# EAGLE design Jar_O_Fireflies (EAGLE 5.11)
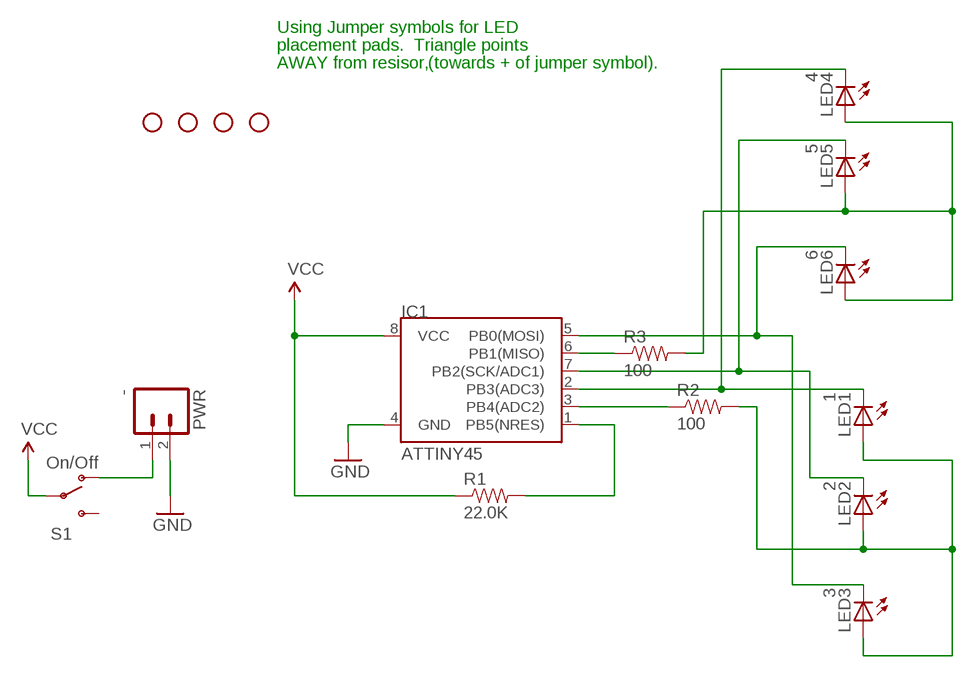
[diagram p0: schematic, sheet 1]

## Parts
IC1  ATTINY45  [SO08-EIAJ]
JP1  STAND-OFF  [STAND-OFF]
JP2  STAND-OFF  [STAND-OFF]
JP3  STAND-OFF  [STAND-OFF]
JP4  STAND-OFF  [STAND-OFF]
LED1  1  LED1206  [LED-1206]
LED2  2  LED1206  [LED-1206]
LED3  3  LED1206  [LED-1206]
LED4  4  LED1206  [LED-1206]
LED5  5  LED1206  [LED-1206]
LED6  6  LED1206  [LED-1206]
PWR  -  M02LOCK  [1X02_LOCK]
R1  22.0K  RESISTOR  [0805]
R2  100  RESISTOR  [0805]
R3  100  RESISTOR  [0805]
S1  On/Off  SWITCH-SPSTSMD2  [SWITCH-SPDT-SMD]

## Nets
GND: IC1.4(GND) PWR.2
N$1: IC1.1(PB5(NRES)) R1.2
N$2: LED1.A LED2.A LED3.A R2.2
N$3: IC1.3(PB4(ADC2)) R2.1
N$4: PWR.1 S1.1(O)
N$5: IC1.2(PB3(ADC3)) LED1.C LED4.C
N$6: IC1.7(PB2(SCK/ADC1)) LED2.C LED5.C
N$7: IC1.5(PB0(MOSI)) LED3.C LED6.C
N$8: IC1.6(PB1(MISO)) R3.1
N$9: LED4.A LED5.A LED6.A R3.2
VCC: IC1.8(VCC) R1.1 S1.2(P)
Unconnected: S1.3(S)

## Notes on the sheet
- Using Jumper symbols for LED
- placement pads.  Triangle points
- AWAY from resisor, | (towards + of jumper symbol).

## Library data of the parts
IC1 = SparkFun:ATTINY45: Atmel ATTiny45
JP1-JP4 = SparkFun:STAND-OFF: Stand Off This is the mechanical footprint for a #4 phillips button head screw. Use the keepout ring to avoid running the screw head into surrounding components. SKU : PRT-00447
LED1-LED6 = SparkFun:LED: LEDs Standard schematic elements and footprints for 5mm, 3mm, 1206, and 0603 sized LEDs. 5mm - Spark Fun Electronics SKU : COM-00529 (and others)
PWR = SparkFun:M02: Header 2 Standard 2-pin 0.1" header. Use with straight break away headers (SKU : PRT-00116), right angle break away headers (PRT-00553), swiss pins (PRT-00743), machine pins (PRT-00117), and female headers (PRT-00115). Molex polarized connector foot print use with SKU : PRT-08233 with associated crimp pins and housings.
R1-R3 = SparkFun:RESISTOR: Resistor Basic schematic elements and footprints for 0603, 1206, and PTH 1/10th watt (small) resistors.
S1 = SparkFun:SWITCH-SPST: SPST Switch Simple slide switch. Spark Fun Electronics SKU : COM-00102

## Board
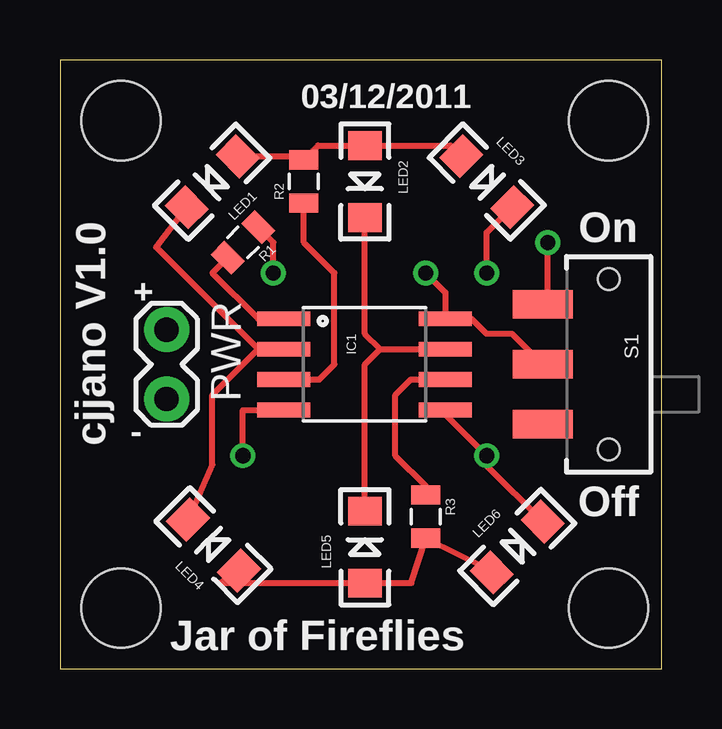
[diagram p1: board, top side]
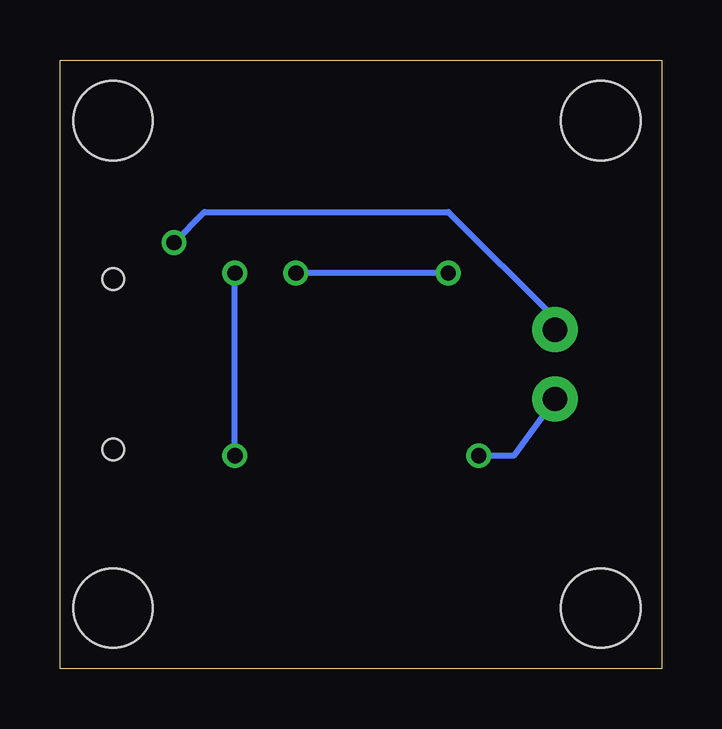
[diagram p2: board, bottom side, seen from below]

Size 25.07 x 25.39 mm. Coordinates in mm from the lower left corner, seen from the top.
Outline: 0,0 25.07,0 25.07,25.39 0,25.39 0,0
Copper layers (1*16): Top 0.035mm / dielectric 1.5mm / Bottom 0.035mm
Design rules "default *": minimum track width 10mil, minimum drill 25mil, track to track 8mil, track to pad 8mil, pad to pad 8mil, via to via 8mil, smd to smd 8mil, copper to edge 40mil, drill to drill 8mil, minimum pad ring 10mil, minimum via ring 8mil, stop-mask expansion 4mil, vias tented up to drill 0mil, thermal gap 10mil

### Footprints (pad centres in the part's own frame; a part is rotated, then mirrored left to right if it is on the bottom)
SO08-EIAJ = smd 0.61 x 2.21: 1 -1.905,-3.378; 2 -0.635,-3.378; 3 0.635,-3.378; 4 1.905,-3.378; 5 1.905,3.353; 6 0.635,3.353; 7 -0.635,3.353; 8 -1.905,3.353
STAND-OFF = hole 3.302: 0,0
LED-1206 = smd 1.2 x 1.4: A -1.5,0; C 1.5,0
1X02_LOCK = drill 1.016 pad 1.88 round: 1 -0.178,0; 2 2.718,0
0805 = smd 0.8 x 1.2: 1 -0.9,0; 2 0.9,0
SWITCH-SPDT-SMD = smd 1.2 x 2.5: 1 -2.5,-2.75; 2 0,-2.75; 3 2.5,-2.75 | hole 0.9: -3.55,0; 3.55,0

### Placement (x,y rotation side)
IC1  12.7,12.7 270 top
JP1  2.54,2.54 0 top
JP2  22.86,2.54 0 top
JP3  2.54,22.86 0 top
JP4  22.86,22.86 0 top
LED1  6.34,20.31 225 top
LED2  12.7,20.32 270 top
LED3  17.78,20.32 315 top
LED4  6.4,5.16 135 top
LED5  12.7,5.08 90 top
LED6  19.05,5.08 45 top
PWR  4.45,13.97 270 top
R1  7.62,17.78 225 top
R2  10.16,20.32 90 top
R3  15.24,6.35 270 top
S1  22.86,12.7 270 top

### Tracks (layer width: path | path; a pad name or v marks a point on that pad's centre or on a via)
GND  (via drill 0.64)
  Top 0.254: IC1.4 7.62,10.79 v7.62,8.89
  Bottom 0.254: v7.62,8.89 6.17,8.89 PWR.2
N$1
  Top 0.254: IC1.1 8.26,14.61 6.35,16.51 R1.2
N$2
  Top 0.254: LED3.A 16.28,21.82 LED2.A 10.76,21.82 R2.2 10.01,21.37 LED1.A
N$3
  Top 0.254: R2.1 10.16,17.78 11.43,16.51 11.43,12.7 10.79,12.06 IC1.3
N$4  (via drill 0.64)
  Top 0.254: S1.1 20.32,15.41 v20.32,17.78
  Bottom 0.254: v20.32,17.78 19.05,19.05 8.89,19.05 4.45,14.61 PWR.1
N$5
  Top 0.254: LED1.C 4.01,17.58 8.26,13.34 | LED4.C 6.35,8.51 6.35,11.43 8.26,13.34 | 8.26,13.34 IC1.2
N$6
  Top 0.254: LED2.C 12.7,13.97 13.34,13.34 | 13.34,13.34 IC1.7 | LED5.C 12.7,12.7 13.34,13.34
N$7  (via drill 0.64)
  Top 0.254: LED3.C 17.78,18.2 v17.78,16.51 | IC1.5 16.05,10.62 v17.78,8.89 17.78,8.47 LED6.C
  Bottom 0.254: v17.78,8.89 v17.78,16.51
N$8
  Top 0.254: R3.1 15.24,7.62 13.97,8.89 13.97,11.43 14.61,12.06 IC1.6
N$9
  Top 0.254: LED6.A 17.83,4.18 R3.2 14.64,3.58 LED5.A 6.71,3.58 LED4.A
VCC  (via drill 0.64)
  Top 0.254: v15.24,16.51 16.05,15.7 IC1.8 17.14,14.61 17.78,13.97 18.84,13.97 S1.2 | v8.89,16.51 8.89,17.78 R1.1
  Bottom 0.254: v8.89,16.51 v15.24,16.51

### Text on the board
tPlace: 03/12/2011 | cjjano V1.0 | On | + | - | Off | Jar of Fireflies